# Altium schematic sheet enc.SchDoc
size A
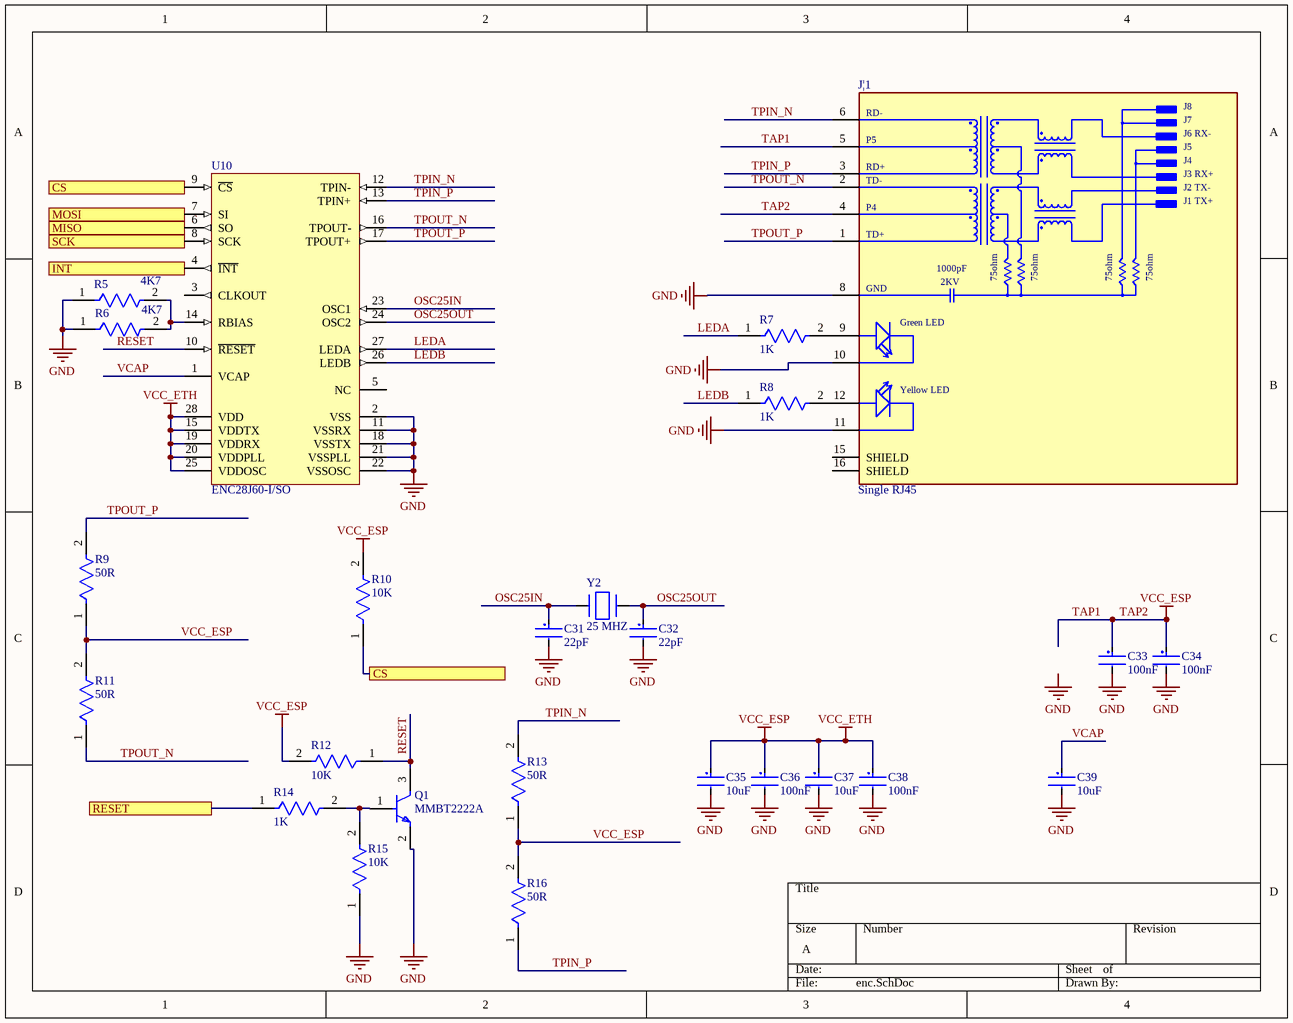
[diagram p0: enc.SchDoc]

## Parts
C31  22pF  [Samsung_CL31_IPC_A_1206]
C32  22pF  [Samsung_CL31_IPC_A_1206]
C33  100nF  [Samsung_CL31_IPC_A_1206]
C34  100nF  [Samsung_CL31_IPC_A_1206]
C35  10uF  [Samsung_CL31_IPC_A_1206]
C36  100nF  [Samsung_CL31_IPC_A_1206]
C37  10uF  [Samsung_CL31_IPC_A_1206]
C38  100nF  [Samsung_CL31_IPC_A_1206]
C39  10uF  [Samsung_CL31_IPC_A_1206]
J|1  Single RJ45  [HANRUN_HR911105A]
Q1  MMBT2222A  [SOT23_M]
R5  4K7  [YAGEO_RC1206-0_65_IPC_A]
R6  4K7  [YAGEO_RC1206-0_65_IPC_A]
R7  1K  [YAGEO_RC1206-0_65_IPC_A]
R8  1K  [YAGEO_RC1206-0_65_IPC_A]
R9  50R  [YAGEO_RC1206-0_65_IPC_A]
R10  10K  [YAGEO_RC1206-0_65_IPC_A]
R11  50R  [YAGEO_RC1206-0_65_IPC_A]
R12  10K  [YAGEO_RC1206-0_65_IPC_A]
R13  50R  [YAGEO_RC1206-0_65_IPC_A]
R14  1K  [YAGEO_RC1206-0_65_IPC_A]
R15  10K  [YAGEO_RC1206-0_65_IPC_A]
R16  50R  [YAGEO_RC1206-0_65_IPC_A]
U10  ENC28J60-I/SO  [SOIC-SO28_M]
Y2  25 MHZ  [CTS_ATS080B_0]

## Ports
CS, INT, MISO, MOSI, RESET, SCK

## Nets
GND: C31.2 C32.2 C33.2 C34.2 C35.2 C36.2 C37.2 C38.2 C39.2 J|1.8(GND) J|1.10(GC) J|1.11(YC) Q1.2(E) R5.1 R6.1 R15.1 U10.2(VSS) U10.11(VSSRX) U10.18(VSSTX) U10.21(VSSPLL) U10.22(VSSOSC)
TAP1: C33.1 C34.1 C35.1 C36.1 C37.1 C38.1 J|1.4(P4) J|1.5(P5) R9.1 R10.2 R11.2 R12.2 R13.1 R16.2 U10.15(VDDTX) U10.19(VDDRX) U10.20(VDDPLL) U10.25(VDDOSC) U10.28(VDD)  [also labelled TAP2, VCC_ESP, VCC_ETH]
CS: R10.1 U10.9(~{CS}) ; port CS
INT: U10.4(~{INT}) ; port INT
LEDA: R7.1 U10.27(LEDA)
LEDB: R8.1 U10.26(LEDB)
MISO: U10.6(SO) ; port MISO
MOSI: U10.7(SI) ; port MOSI
OSC25IN: C31.1 U10.23(OSC1) Y2.1
OSC25OUT: C32.1 U10.24(OSC2) Y2.2
RESET: R14.1 ; port RESET
RESET: Q1.3(C) R12.1 U10.10(~{RESET})  [a separate net that carries the same name]
SCK: U10.8(SCK) ; port SCK
TPIN_N: J|1.6(RD-) R13.2 U10.12(TPIN-)
TPIN_P: J|1.3(RD+) R16.1 U10.13(TPIN+)
TPOUT_N: J|1.2(TD-) R11.1 U10.16(TPOUT-)
TPOUT_P: J|1.1(TD+) R9.2 U10.17(TPOUT+)
VCAP: C39.1 U10.1(VCAP)
NetJ|1_9: J|1.9(GA) R7.2
NetJ|1_12: J|1.12(YA) R8.2
NetQ1_1: Q1.1(B) R14.2 R15.2
NetR5_2: R5.2 R6.2 U10.14(RBIAS)

Not connected (* = marked no-connect by the designer): J|1 15(SHIELD) 16(SHIELD); U10 3(CLKOUT) 5(NC)

## Notes on the sheet
- Labels drawn without touching a wire or pin: GND
- (in symbol HR911105A) J8; J7; J6 RX-; J5; J4; J3 RX+; J2 TX-; J1 TX+; 1000pF; 75ohm; 2KV; Green LED; Yellow LED

## Library data of the parts
C31 C32 = CL31C220JIFNFNE: CAP CER 22PF 1KV C0G/NP0 1206, ±5% 1000V (1kV) Ceramic Capacitor C0G, NP0 1206 (3216 Metric); Supplier 1: Digi-Key; Supplier Part Number 1: 1276-3227-1-ND
C33 C34 C36 C38 = CL31B104KBCNFNC: CAP CER 0.1UF 50V X7R 1206, ±10% 50V Ceramic Capacitor X7R 1206 (3216 Metric); Supplier 1: Digi-Key; Supplier Part Number 1: 1276-2744-1-ND
C35 C37 C39 = CL31A106KQHNNWE: CAP CER 10UF 6.3V X5R 1206, ±10% 6.3V Ceramic Capacitor X5R 1206 (3216 Metric); Supplier 1: Digi-Key; Supplier Part Number 1: 1276-3043-1-ND
J|1 = HR911105A: HR911105A Ethernet Interface Arduino Platform Evaluation Expansion Board; MF: DFRobot; Package: None; Availability: Unavailable; MP: HR911105A; Value: *; SnapEDA_Link: https://www.snapeda.com/parts/HR911105A/DFRobot/view-part/214807/?ref=snap; Price: None
Q1 = MMBT2222A_eec_1: TRANS NPN 40V 1A SOT-23; Manufacturer: ON Semiconductor; Category 9E07530Daf1645C0: Semiconductors and Actives; Num Pins: 3; voltage_rating_dc: 40.00V; Category 2F8Ae2801E7Ef44D: Uncategorized; Category 3B27F62D0A3Ae0E0: Discretes (diodes, transistors, thyristors ...); power_dissipation: 0.35W; polarity: N-Channel, NPN; Type: transistor; Category D77D1A77E69F0Cba: Transistors; current_rating: .5A; Category B814751E89Ff63D3: BJTs; Symbol 0 0: BJT (NPN); Part Number: MMBT2222A; helpURL: https://upverter.com/upn/revision/feda0579b01a29cc/; ComponentLink2Description: Datasheet; Temperature: -55°C to +150°C; Package: SOT-23; Supplier 2: Mouser; Price: 0.0804309879024; Supplier 1: Digi-Key; ComponentLink1URL: https://upverter.com/upn/revision/feda0579b01a29cc/; Supplier Part Number 2: 512-MMBT2222A; Supplier Part Number 1: MMBT2222AFSCT-ND; ComponentLink1Description: Upverter; ComponentLink2URL: https://www.fairchildsemi.com/datasheets/MM/MMBT2222A.pdf; RoHS: TRUE; Mouser Part Number: 512-MMBT2222A; Category A8D365D999257314: Uncategorized; Temperature Range High: +150°C; Octopart Part Number: 0c07c5085cb0d3c0; Digikey Description: TRANS NPN 40V 1A SOT-23; Digikey Part Number: MMBT2222AFSCT-ND; Lead Free: yes; Category 931F5E15A77D48D8: Uncategorized; Temperature Range Low: -55°C; breakdown_voltage_collector_to_emitter: 40.00V; Mounting Type: surface mount
R5 R6 = RC1206FR-074K7L: 4.7 ±1% 0.25W, 1/4W Chip Resistor 1206 (3216 Metric) Moisture Resistant Thick Film; Supplier 1: Arrow Electronics; Supplier Part Number 1: RC1206FR-07 4K7L
R7-R9 R11 R13 R16 = RC1206JR-07100RL: 100 ±5% 0.25W, 1/4W Chip Resistor 1206 (3216 Metric) Moisture Resistant Thick Film; Supplier 1: Newark; Supplier Part Number 1: 12AC2283
R10 R12 R15 = RC1206FR-0710KL: 10 ±1% 0.25W, 1/4W Chip Resistor 1206 (3216 Metric) Moisture Resistant Thick Film; Supplier 1: Digi-Key; Supplier Part Number 1: 311-10.0KFRCT-ND
R14 = RC1206JR-071KL: 1 ±5% 0.25W, 1/4W Chip Resistor 1206 (3216 Metric) Moisture Resistant Thick Film; Supplier 1: Digi-Key; Supplier Part Number 1: 311-1.0KERCT-ND
U10 = ENC28J60-I/SO: Stand-Alone Ethernet Controller with SPI Interface, 28-Pin SOIC, Industrial Temperature; ComponentLink1Description: Manufacturer URL; ComponentLink2Description: Datasheet; DatasheetVersion: revC, Jan-2008; ComponentLink3URL: http://www.microchip.com/stellent/groups/techpub_sg/documents/packagingspec/en012702.pdf; ComponentLink3Description: Package Specification; ComponentLink1URL: http://www.microchip.com/; Code_JEDEC: MS-013; RevisionNote: URLs added.; PackageVersion: revBB, Aug-2009; PackageDescription: 28-Lead Plastic Small Outline (SO) - Wide 7.50mm Body [SOIC]; ComponentLink2URL: http://ww1.microchip.com/downloads/en/DeviceDoc/39662c.pdf; PackageReference: SOIC-SO28; PartNumber: ENC28J60-I/SO; Supplier 1: RSComponents; Supplier Part Number 1: 6988987
Y2 = CRYSTAL 8.000MHZ: CRYSTAL 8.000MHZ 20PF THRU; Manufacturer: TXC; Manufacturer Part Number: 9B-8.000MBBK-B; Frequency Stability: 50ppm; Frequency: 8MHz; ESR (Equivalent Series Resistance): 80R; Supplier 1: Digi-Key; RoHS: Yes; Category: Crystals; Pricing 1: 1000=0.16000 (USD); Mount: Through Hole; Case/Package: Metal; Min Operating Temperature: -20°C; Max Operating Temperature: 70°C; Package Quantity: 1000; Frequency Tolerance: 50ppm; Load Capacitance: 20pF; Packaging: Bulk; Length: 0.453inch; Width: 0.197inch; Height: 0.145inch; ComponentLink1URL: https://datasheet.ciiva.com/6733/9b-6733750.pdf?src-supplier=Digi-Key; ComponentLink1Description: https://datasheet.ciiva.com/6733/9b-6733750.pdf?src-supplier=Digi-Key; ComponentLink2URL: https://datasheet.ciiva.com/29631/9b-29631174.pdf?src-supplier=Digi-Key; ComponentLink2Description: https://datasheet.ciiva.com/29631/9b-29631174.pdf?src-supplier=Digi-Key; Supplier Part Number 1: 887-2033-ND